# EAGLE design EL-100-020-010-AnalogIN (EAGLE 6.6.0)
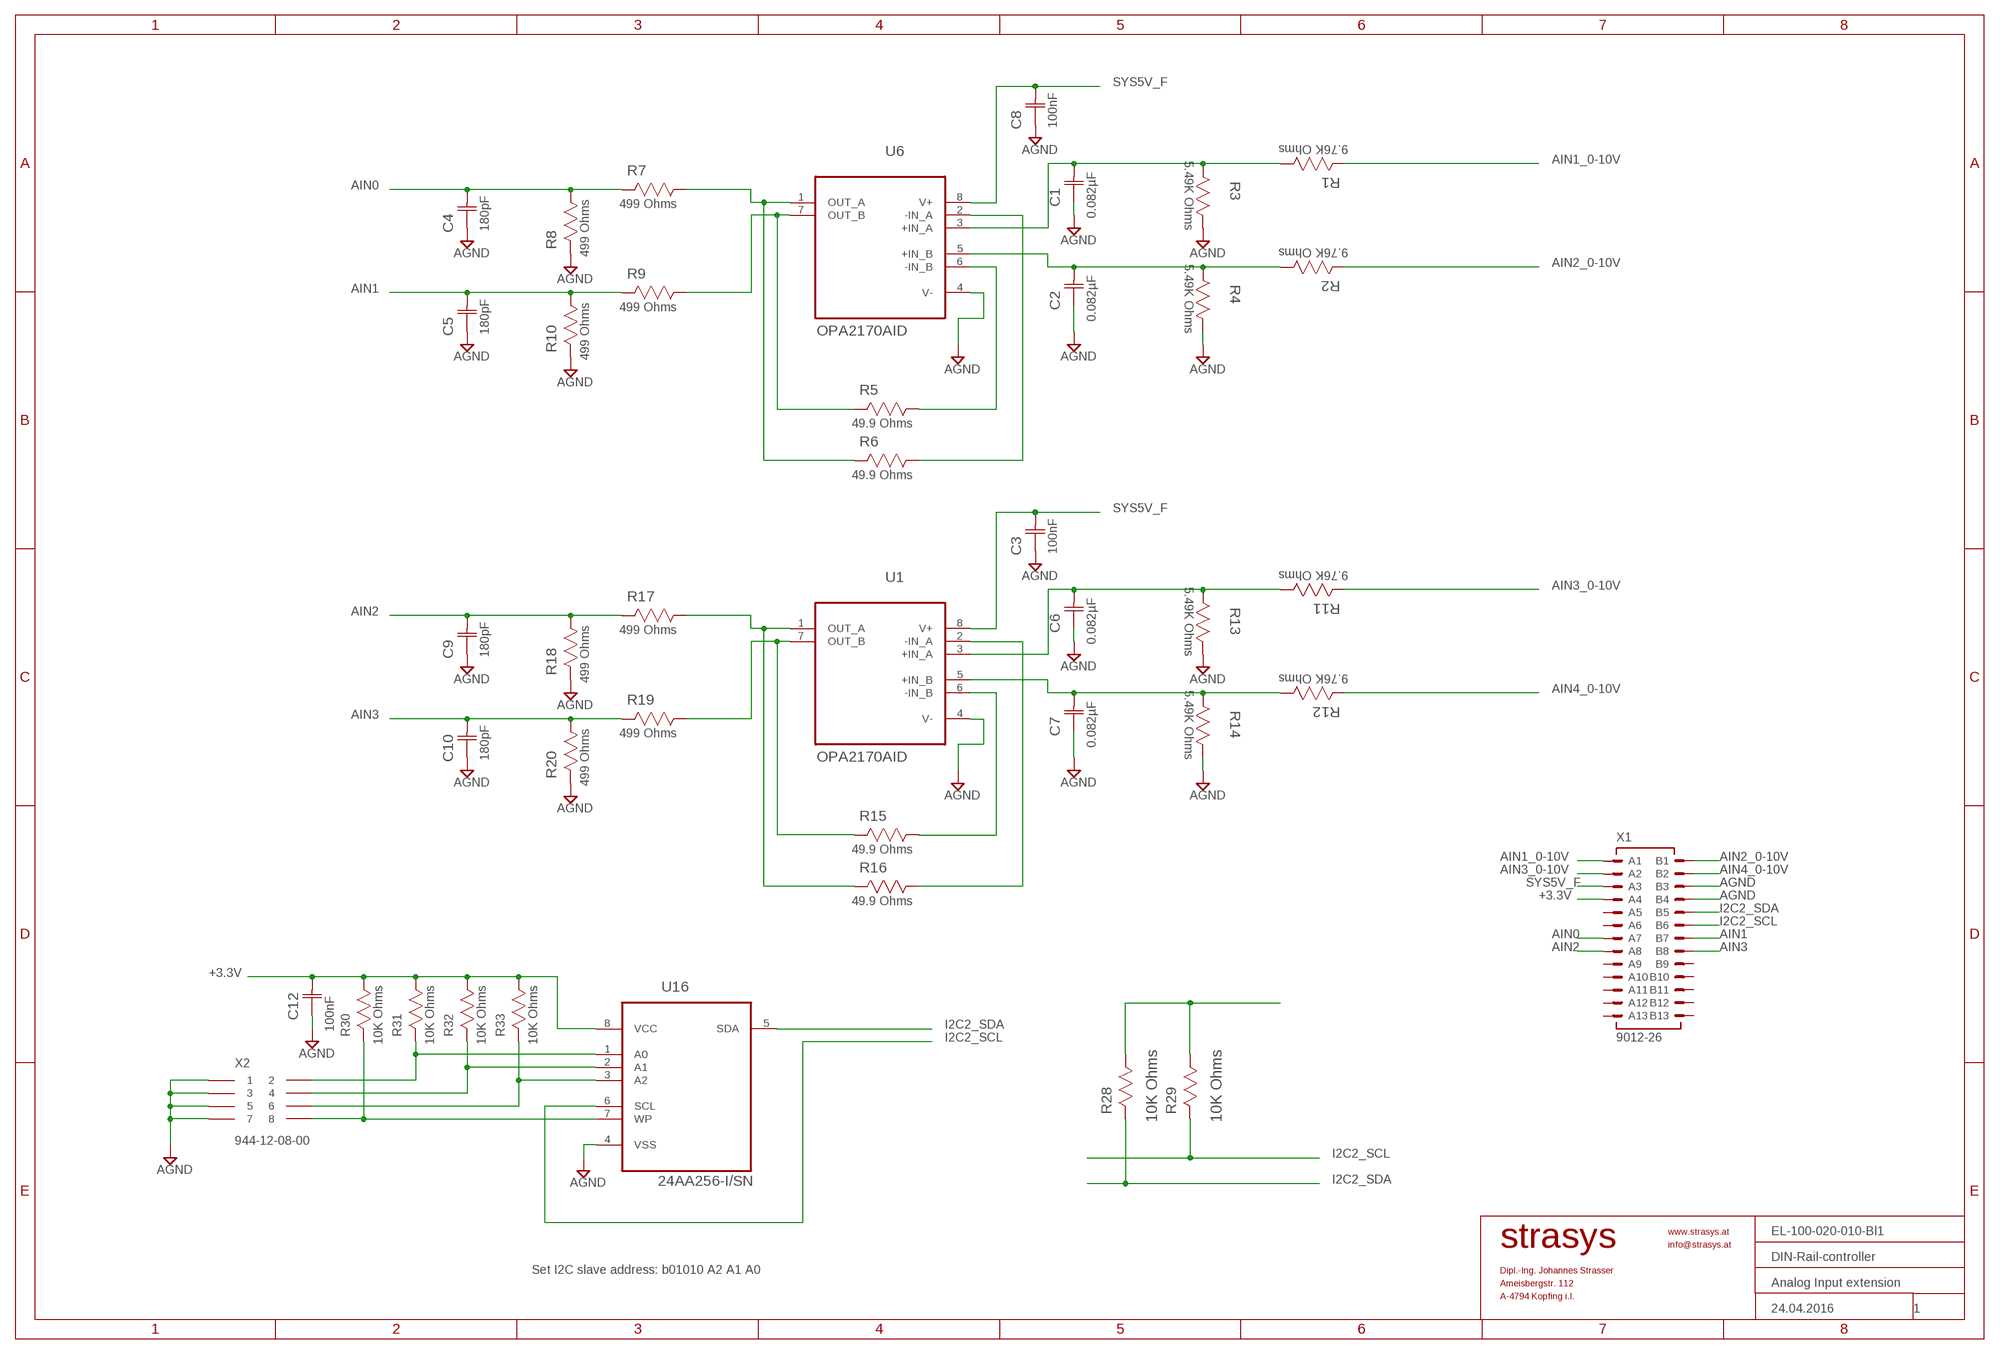
[diagram p0: schematic, sheet 1]
FRAME1 (A3L-LOC): DATE_DRAWING: 24.04.2016; DRAWING_NAME1: DIN-Rail-controller; DRAWING_NAME2: Analog Input extension; DRAWING_NO: EL-100-020-010-Bl1; PAGE: 1

## Parts
C1  0.082µF  C0805C180J5GACTU  [CAPC2013X88N]
C2  0.082µF  C0805C180J5GACTU  [CAPC2013X88N]
C3  100nF  C0805C104K5RACTU  [CAPC2013X110N]
C4  180pF  C0805C180J5GACTU  [CAPC2013X88N]
C5  180pF  C0805C180J5GACTU  [CAPC2013X88N]
C6  0.082µF  C0805C180J5GACTU  [CAPC2013X88N]
C7  0.082µF  C0805C180J5GACTU  [CAPC2013X88N]
C8  100nF  C0805C104K5RACTU  [CAPC2013X110N]
C9  180pF  C0805C180J5GACTU  [CAPC2013X88N]
C10  180pF  C0805C180J5GACTU  [CAPC2013X88N]
C12  100nF  C0805C104K5RACTU  [CAPC2013X110N]
R1  9.76K Ohms  CRCW08059K76FKEA  [RESC2013X65N]
R2  9.76K Ohms  CRCW08059K76FKEA  [RESC2013X65N]
R3  5.49K Ohms  CRCW08055K49FKEA  [RESC2013X65N]
R4  5.49K Ohms  CRCW08055K49FKEA  [RESC2013X65N]
R5  49.9 Ohms  CRCW080549R9FKEA  [RESC2013X65N]
R6  49.9 Ohms  CRCW080549R9FKEA  [RESC2013X65N]
R7  499 Ohms  CRCW0805499RFKEA  [RESC2013X65N]
R8  499 Ohms  CRCW0805499RFKEA  [RESC2013X65N]
R9  499 Ohms  CRCW0805499RFKEA  [RESC2013X65N]
R10  499 Ohms  CRCW0805499RFKEA  [RESC2013X65N]
R11  9.76K Ohms  CRCW08059K76FKEA  [RESC2013X65N]
R12  9.76K Ohms  CRCW08059K76FKEA  [RESC2013X65N]
R13  5.49K Ohms  CRCW08055K49FKEA  [RESC2013X65N]
R14  5.49K Ohms  CRCW08055K49FKEA  [RESC2013X65N]
R15  49.9 Ohms  CRCW080549R9FKEA  [RESC2013X65N]
R16  49.9 Ohms  CRCW080549R9FKEA  [RESC2013X65N]
R17  499 Ohms  CRCW0805499RFKEA  [RESC2013X65N]
R18  499 Ohms  CRCW0805499RFKEA  [RESC2013X65N]
R19  499 Ohms  CRCW0805499RFKEA  [RESC2013X65N]
R20  499 Ohms  CRCW0805499RFKEA  [RESC2013X65N]
R28  10K Ohms  CRCW080510K0JNEA  [RESC2013X65N]
R29  10K Ohms  CRCW080510K0JNEA  [RESC2013X65N]
R30  10K Ohms  CRCW080510K0JNEA  [RESC2013X65N]
R31  10K Ohms  CRCW080510K0JNEA  [RESC2013X65N]
R32  10K Ohms  CRCW080510K0JNEA  [RESC2013X65N]
R33  10K Ohms  CRCW080510K0JNEA  [RESC2013X65N]
U1  OPA2170AID  [SOIC127P600X175-8N]
U6  OPA2170AID  [SOIC127P600X175-8N]
U16  24AA256-I/SN  [SOIC127P600X175-8N]
X1  9012-26  [9012-26]
X2  944-12-08-00  [2,54_2X8]

## Nets
24AA-A0: R31.2 U16.1(A0) X2.P2
24AA_A1: R32.2 U16.2(A1) X2.P4
24AA_A2: R33.2 U16.3(A2) X2.P6
24AA_WP: R30.2 U16.7(WP) X2.P8
+3.3V: C12.2(C2) R28.1 R29.1 R30.1 R31.1 R32.1 R33.1 U16.8(VCC) X1.A4
AGND: C1.1(C1) C2.1(C1) C3.1(C1) C4.1(C1) C5.1(C1) C6.1(C1) C7.1(C1) C8.1(C1) C9.1(C1) C10.1(C1) C12.1(C1) R3.1 R4.1 R8.2 R10.2 R13.1 R14.1 R18.2 R20.2 U1.4(V-) U6.4(V-) U16.4(VSS) X1.B3 X1.B4 X2.P1 X2.P3 X2.P5 X2.P7
AIN0: C4.2(C2) R7.2 R8.1 X1.A7
AIN1: C5.2(C2) R9.2 R10.1 X1.B7
AIN1_0-10V: R1.2 X1.A1
AIN2: C9.2(C2) R17.2 R18.1 X1.A8
AIN2_0-10V: R2.2 X1.B1
AIN3: C10.2(C2) R19.2 R20.1 X1.B8
AIN3_0-10V: R11.2 X1.A2
AIN4_0-10V: R12.2 X1.B2
I2C2_SCL: R29.2 U16.6(SCL) X1.B6
I2C2_SDA: R28.2 U16.5(SDA) X1.B5
N$1: C6.2(C2) R11.1 R13.2 U1.3(+IN_A)
N$3: C7.2(C2) R12.1 R14.2 U1.5(+IN_B)
N$21: C1.2(C2) R1.1 R3.2 U6.3(+IN_A)
N$45: C2.2(C2) R2.1 R4.2 U6.5(+IN_B)
OPA2170_-IN_A_1: R16.1 U1.2(-IN_A)
OPA2170_-IN_A_2: R6.1 U6.2(-IN_A)
OPA2170_-IN_B_1: R15.1 U1.6(-IN_B)
OPA2170_-IN_B_2: R5.1 U6.6(-IN_B)
OPA2170_OUT_A_1: R16.2 R17.1 U1.1(OUT_A)
OPA2170_OUT_A_2: R6.2 R7.1 U6.1(OUT_A)
OPA2170_OUT_B_1: R15.2 R19.1 U1.7(OUT_B)
OPA2170_OUT_B_2: R5.2 R9.1 U6.7(OUT_B)
SYS5V_F: C3.2(C2) C8.2(C2) U1.8(V+) U6.8(V+) X1.A3
Unconnected: X1.A5 X1.A6 X1.A9 X1.A10 X1.A11 X1.A12 X1.A13 X1.B9 X1.B10 X1.B11 X1.B12 X1.B13

## Notes on the sheet
- Set I2C slave address: b01010 A2 A1 A0

## Library data of the parts
C1 C2 C6 C7 = Kemet_By_element14_1:C0805C180J5GACTU: CAPACITOR, 0805; MPN: MC0805B823K500CT; OC_FARNELL: 1759264; SUPPLIER: MULTICOMP; TOLERANCE: ±10%; VALUE: 18pF; VOLTAGERATING: 50V
C3 C8 C12 = Kemet_By_element14_1:C0805C104K5RACTU: CAPACITOR, 0805; MF: KEMET; MPN: C0805C104K5RACTU; OC_FARNELL: 1414664; OC_NEWARK: 65H7431; SUPPLIER: Kemet; TOLERANCE: ±10%; VOLTAGERATING: 50V
C4 C5 C9 C10 = Kemet_By_element14_1:C0805C180J5GACTU: CAPACITOR, 0805; MF: KEMET; MPN: C0805C181J5GACTU; OC_FARNELL: 1414674; SUPPLIER: Kemet; TOLERANCE: ±5%; VALUE: 18pF; VOLTAGERATING: 50V
R1 R2 R11 R12 = Vishay_By_element14_Batch_1:CRCW08059K76FKEA: RESISTOR, 0805; MPN: MCTC0525B9761T5E; OC_FARNELL: 1575899; SUPPLIER: MULTICOMP; TOLERANCE: ±0.1%; WATTAGE: 0.125 W
R3 R4 R13 R14 = Vishay_By_element14_Batch_1:CRCW08055K49FKEA: RESISTOR, 0805; MPN: PCF0805R-5K49BI; OC_FARNELL: 1160182; SUPPLIER: WELWYN; TOLERANCE: ±0.1%; WATTAGE: 0.125 W
R5 R6 R15 R16 = Vishay_By_element14_Batch_1:CRCW080549R9FKEA: RESISTOR, 0805; MPN: MCTC0525B499JT5E; OC_FARNELL: 1575515; SUPPLIER: MULTICOMP; TOLERANCE: ±0.1%; WATTAGE: 0.1 W
R7-R10 R17-R20 = Vishay_By_element14_Batch_1:CRCW0805499RFKEA: RESISTOR, 0805; MPN: ERA6AEB4990V; OC_FARNELL: 1810472; SUPPLIER: PANASONIC ELECTRONIC COMPONENTS; TOLERANCE: ±0.1%; WATTAGE: 0.125 W
R28-R33 = Vishay_By_element14_Batch_1:CRCW080510K0JNEA: RESISTOR, 0805; MF: VISHAY DRALORIC; MPN: CRCW080510K0JNEA; OC_FARNELL: 1469857; OC_NEWARK: 52K9797; SUPPLIER: Vishay; TOLERANCE: ±5%; WATTAGE: 0.125 W
U1 U6 = strasys_standard:OPA2170AID: Low-Power OPERATIONAL AMPLIFIERS,SOIC- 8; MF: TEXAS INSTRUMENTS; MPN: OPA2170AID; OC_FARNELL: 2144252; OC_NEWARK: 05W9871; PACKAGE: SOIC- 8; SUPPLIER: TEXAS INSTRUMENTS
U16 = Microchip_By_element14_Batch_1:24AA256-I/SN: EEPROM; MF: MICROCHIP; MPN: 24AA256-I/SN; OC_FARNELL: 1331295; OC_NEWARK: 92C6874; PACKAGE: SOIC-8; SUPPLIER: MICROCHIP
X1 = con-WuP:9012-26: SMT-Buchsenleiste RM 1,27mm, liegend; MPN: 9012-26; SUPPLIER: W+P
X2 = strasys_standard:944-12-08-00: Stiftleiste RM 2,54mm gerade 2 x 4

## Board
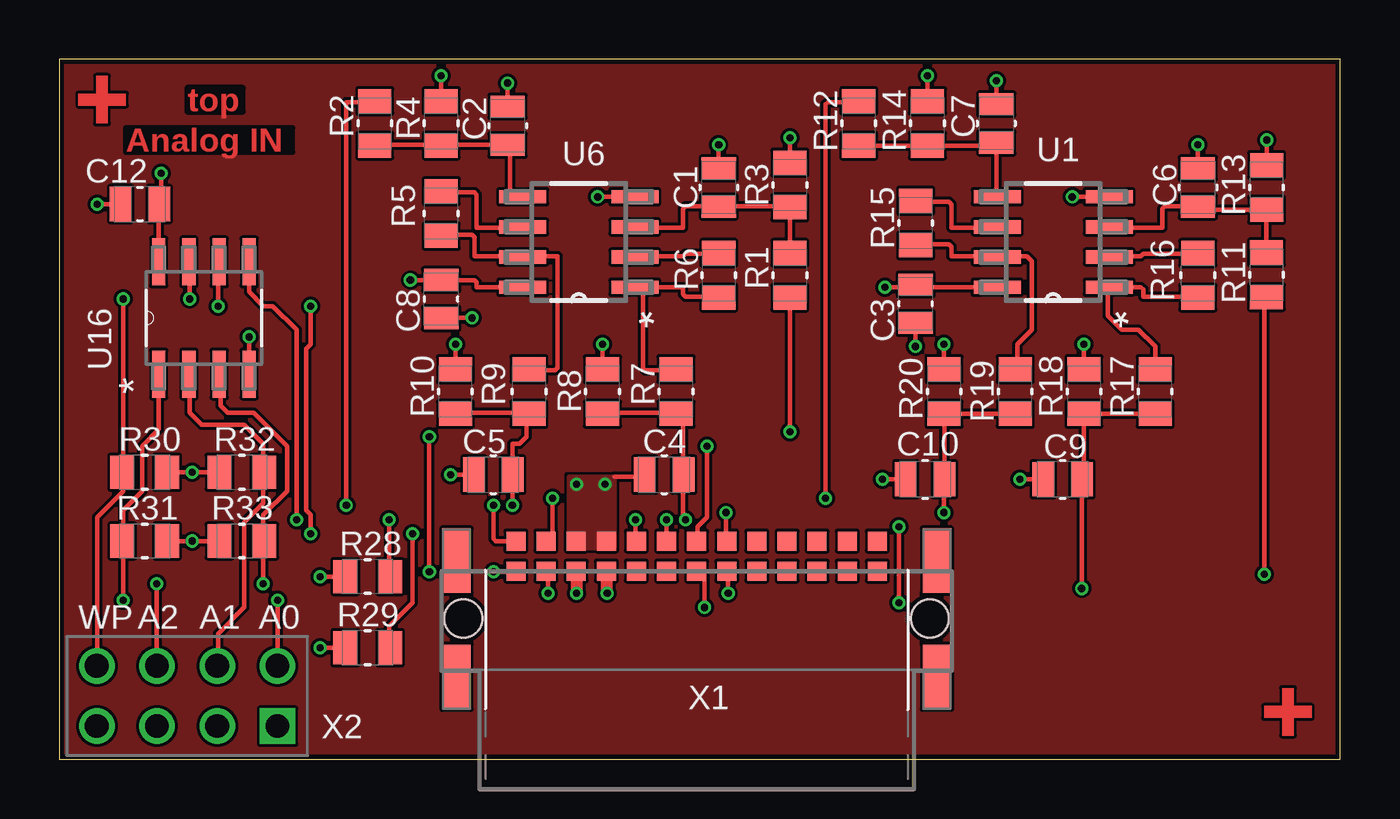
[diagram p1: board, top side]
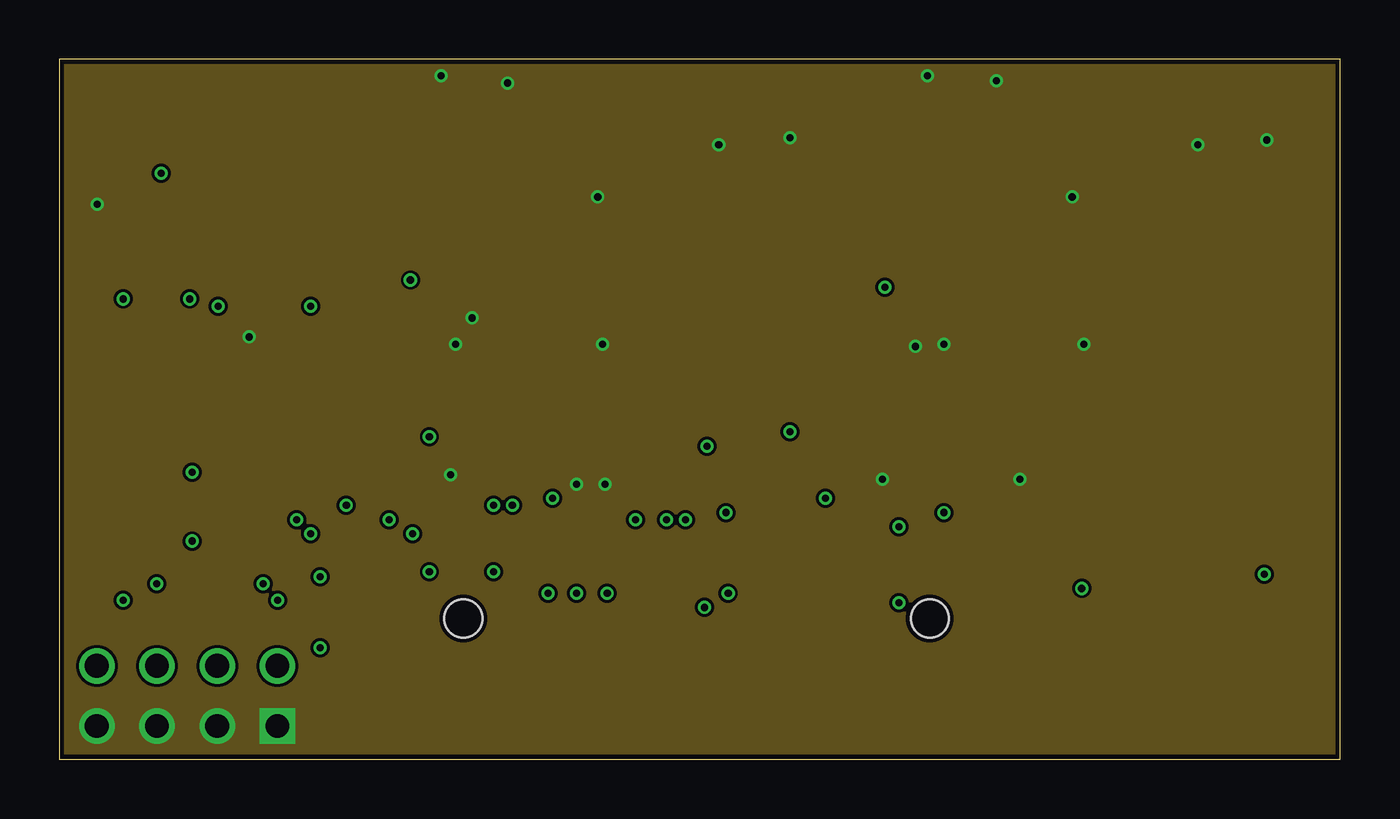
[diagram p2: board, inner layer GND]
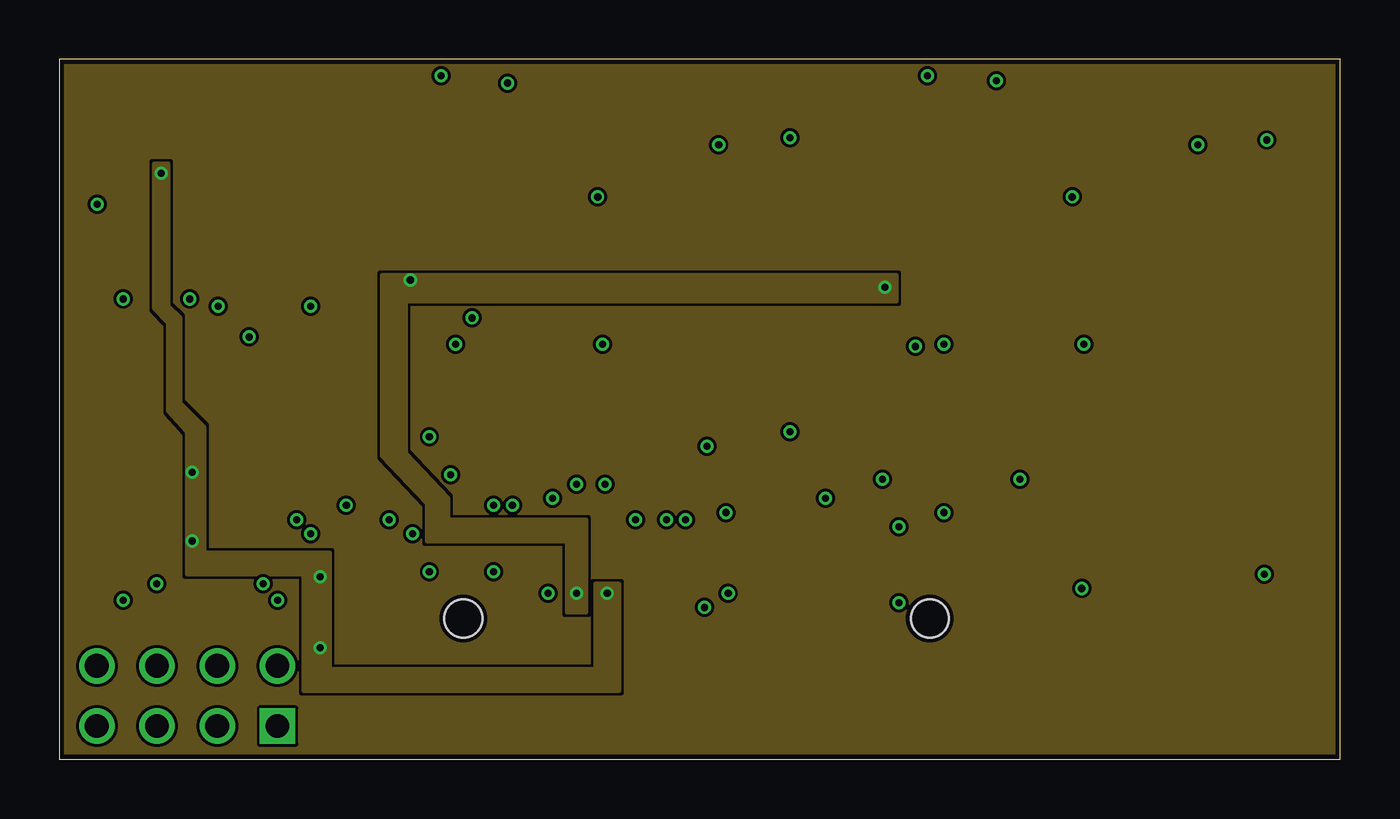
[diagram p3: board, inner layer PWR]
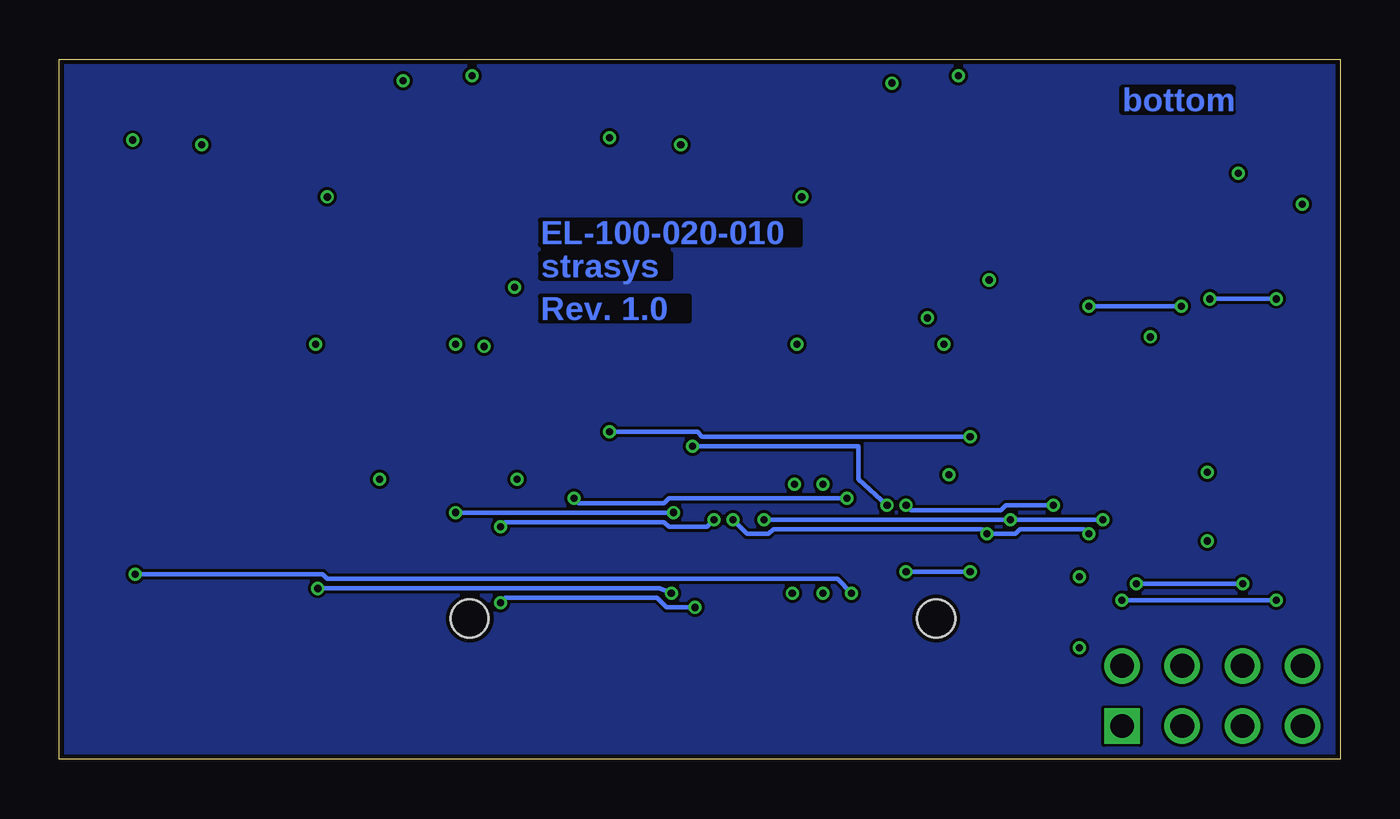
[diagram p4: board, bottom side, seen from below]

Size 54 x 29.5 mm. Coordinates in mm from the lower left corner, seen from the top.
Outline: 0,0 54,0 54,29.5 0,29.5 0,0
Copper layers (1+2*15+16): Top 0.018mm / dielectric 0.36mm / GND 0.035mm / dielectric 0.71mm / PWR 0.035mm / dielectric 0.2mm / Bottom 0.018mm
Design rules "Multi-CB_4L_125um-Tracks_OL35um-IL35um *": minimum track width 0.125mm, minimum drill 0.2mm, track to track 0.125mm, track to pad 0.125mm, pad to pad 0.125mm, via to via 0.125mm, smd to smd 0mil, copper to edge 0.2mm, drill to drill 0.2mm, minimum pad ring 0.125mm, minimum via ring 0.125mm, stop-mask expansion 2mil, vias tented up to drill 0.45mm, thermal gap 0.2mm

### Footprints (pad centres in the part's own frame; a part is rotated, then mirrored left to right if it is on the bottom)
CAPC2013X88N = smd 0.914 x 1.448: 1 -0.813,0; 2 0.813,0
CAPC2013X110N = smd 0.914 x 1.448: 1 -0.813,0; 2 0.813,0
RESC2013X65N = smd 1.016 x 1.397: 1 -0.94,0; 2 0.94,0
SOIC127P600X175-8N = smd 1.981 x 0.559: 1 -2.362,1.905; 2 -2.362,0.635; 3 -2.362,-0.635; 4 -2.362,-1.905; 5 2.362,-1.905; 6 2.362,-0.635; 7 2.362,0.635; 8 2.362,1.905
9012-26 = smd 0.8 x 0.8: A1 -7.62,2; A2 -6.35,2; A3 -5.08,2; A4 -3.81,2; A5 -2.54,2; A6 -1.27,2; A7 0,2; A8 1.27,2; A9 2.54,2; A10 3.81,2; A11 5.08,2; A12 6.35,2; A13 7.62,2; B1 -7.62,3.27; B2 -6.35,3.27; B3 -5.08,3.27; B4 -3.81,3.27; B5 -2.54,3.27; B6 -1.27,3.27; B7 0,3.27; B8 1.27,3.27; B9 2.54,3.27; B10 3.81,3.27; B11 5.08,3.27; B12 6.35,3.27; B13 7.62,3.27 | smd 1.2 x 2.7: M1 -10.13,2.45; M2 -10.13,-2.45; M3 10.13,2.45; M4 10.13,-2.45 | hole 1.6: -9.83,0; 9.83,0
2,54_2X8 = drill 1 square: P1 0,0 | drill 1: P2 0,-2.54; P3 2.54,0; P4 2.54,-2.54; P5 5.08,0; P6 5.08,-2.54; P7 7.62,0; P8 7.62,-2.54

### Placement (x,y rotation side)
C1  27.8,24.1 270 top
C2  18.9,26.7 270 top
C3  36.1,19.2 90 top
C4  25.5,12 0 top
C5  18.3,12 0 top
C6  48,24.1 270 top
C7  39.5,26.8 270 top
C8  16.1,19.4 90 top
C9  42.3,11.8 0 top
C10  36.5,11.8 0 top
C12  3.4,23.4 0 top
R1  30.8,20.4 270 top
R2  13.3,26.8 90 top
R3  30.8,24.2 270 top
R4  16.1,26.8 270 top
R5  16.1,23 270 top
R6  27.8,20.4 270 top
R7  26,15.5 270 top
R8  22.9,15.5 90 top
R9  19.8,15.5 270 top
R10  16.7,15.5 90 top
R11  50.89,20.42 270 top
R12  33.7,26.8 90 top
R13  50.9,24.1 270 top
R14  36.6,26.8 270 top
R15  36.1,22.6 270 top
R16  48,20.4 270 top
R17  46.2,15.5 270 top
R18  43.2,15.5 90 top
R19  40.3,15.5 270 top
R20  37.3,15.5 90 top
R28  13,7.7 0 top
R29  13,4.7 0 top
R30  3.6,12.1 180 top
R31  3.6,9.2 180 top
R32  7.7,12.1 0 top
R33  7.7,9.2 0 top
U1  41.9,21.8 180 top
U6  21.9,21.8 180 top
U16  6.1,18.6 90 top
U$1  [PASSER_SMD4]  1.8,27.8 0 top
U$2  [PASSER_SMD4]  51.8,2 0 top
X1  26.87,5.93 0 top
X2  9.2,1.4 180 top

### Tracks (layer width: path | path; a pad name or v marks a point on that pad's centre or on a via)
24AA-A0  (via drill 0.3)
  Top 0.2: v2.7,6.7 2.7,9.2 | X2.P2 v9.2,6.7 | 2.7,9.2 2.7,10.5 3.5,11.3 3.5,13.2 4.2,13.9 4.2,16.2 U16.1 | 2.7,9.2 R31.2
  Bottom 0.2: v9.2,6.7 v2.7,6.7
24AA_A1
  Top 0.2: 8.6,12.1 8.6,10.8 7.8,10 7.8,6.4 6.7,5.3 6.7,4 X2.P4 | 8.6,12.1 R32.2 | 8.6,12.1 8.6,13.3 7.8,14.1 6,14.1 5.5,14.6 5.5,16.2 U16.2
24AA_A2  (via drill 0.3)
  Top 0.2: v8.6,7.4 8.6,9.2 | v4.1,7.4 4.1,4 X2.P6 | 8.6,9.2 8.6,10.3 9.6,11.3 9.6,13.2 8.2,14.6 7.1,14.6 6.8,14.9 6.8,16.17 U16.3 | 8.6,9.2 R33.2
  Bottom 0.2: v4.1,7.4 v8.6,7.4
24AA_WP  (via drill 0.3)
  Top 0.2: 2.7,12.1 2.7,11.3 1.6,10.2 1.6,4 X2.P8 | v5.5,19.4 5.5,20.9 U16.7 | 2.7,12.1 v2.7,19.4 | 2.7,12.1 R30.2
  Bottom 0.2: v2.7,19.4 v5.5,19.4
+3.3V  (via drill 0.3)
  Top 0.2: U16.8 4.2,21 C12.2 4.3,23.49 v4.3,24.7 | R31.1 v5.6,9.2 R33.1 | R30.1 v5.6,12.1 R32.1 | v11,7.7 R28.1 | v11,4.7 R29.1
  Top 0.5: v23.1,7 23.1,7.89 X1.A4
  pour PWR (no thermals): 22.6,7.4 22.6,3.8 11.4,3.8 11.4,8.7 6.1,8.7 6.1,14 5.1,15 5.1,18.6 4.6,19.1 4.6,25.1 4,25.1 4,19 4.6,18.4 4.6,14.7 5.4,13.8 5.4,7.8 10.3,7.8 10.3,2.9 23.6,2.9 23.6,7.4
AGND  (via drill 0.3)
  Top 0.2: C12.1 v1.6,23.4 | U16.4 v8.01,17.8 v8,17.8 | v36.6,28.8 R14.1 | v39.5,28.6 C7.1 | C6.1 v48,25.9 | R13.1 v50.9,26.1 | v42.7,23.7 44.2,23.7 U1.4 | C3.1 v36.1,17.4 | R20.2 v37.3,17.5 | C10.1 v34.7,11.8 | C9.1 v40.5,11.8 | R18.2 v43.2,17.5 | 23.4,11.9 24.7,11.9 C4.1 | R10.2 v16.7,17.5 | R8.2 v22.9,17.5 | C5.1 v16.5,12 | v17.4,18.6 C8.1 | v16.1,28.8 R4.1 | v18.9,28.5 C2.1 | v27.8,25.9 C1.1 | v30.8,26.2 R3.1 | v22.7,23.7 24.2,23.7 U6.4
  other vias: 21.8,11.6 23,11.6
  pour GND (no thermals): 0,0 0,29.5 54,29.5 54,0
  pour Top (no thermals): 21.5,11.9 21.5,8.9 23.4,8.9 23.4,11.9
AIN0  (via drill 0.3)
  Top 0.2: C4.2 26.3,10.2 v26.4,10.1 | v35.4,6.6 v35.4,9.8 | v27.2,6.4 27.2,7.9 26.9,7.9 X1.A7 | C4.2 26.3,14.6 26,14.6 | C4.2 | 26,14.6 22.9,14.6 R8.1 | 26,14.6 R7.2
  Bottom 0.2: v26.4,10.1 26.7,9.8 28.3,9.8 28.5,10 35.2,10 v35.4,9.8 | v35.4,6.6 35.2,6.8 28.8,6.8 28.4,6.4 v27.2,6.4
AIN1  (via drill 0.3)
  Top 0.2: v27.3,13.2 27.3,10.2 26.9,9.8 26.9,9.2 X1.B7 | C5.2 | v19.1,10.7 C5.2 | C5.2 19.1,13.3 19.4,13.3 19.7,13.6 19.7,14.6 | 19.7,14.6 19.8,14.6 R9.2 19.7,14.6 | 19.7,14.6 16.7,14.6 R10.1
  Bottom 0.2: v27.3,13.2 20.3,13.2 20.3,11.8 v19.1,10.7
AIN1_0-10V  (via drill 0.3)
  Top 0.2: v30.8,13.8 R1.2 | v15.6,7.9 v15.6,13.6 | v18.3,7.9 19.2,7.9 X1.A1
  Bottom 0.2: v30.8,13.8 27.1,13.8 26.9,13.6 v15.6,13.6 | v18.3,7.9 v15.6,7.9
AIN2  (via drill 0.3)
  Top 0.2: R17.2 R18.1 43.2,11.89 C9.2 v43.1,7.2 | v28.2,7 28.2,7.9 X1.A8
  Bottom 0.2: v43.1,7.2 28.7,7.2 v28.2,7
AIN2_0-10V  (via drill 0.3)
  Top 0.2: v12.1,10.7 12.1,27.7 13.3,27.7 R2.2 | v18.3,10.7 18.3,9.3 18.4,9.2 X1.B1
  Bottom 0.2: v12.1,10.7 14.1,10.7 14.3,10.5 18.1,10.5 v18.3,10.7
AIN3  (via drill 0.3)
  Top 0.2: R19.2 R20.1 37.31,14.55 C10.2 v37.3,10.4 | v28.1,10.4 28.1,9.2 X1.B8
  Bottom 0.2: v28.1,10.4 v37.3,10.4
AIN3_0-10V  (via drill 0.3)
  Top 0.2: v20.6,7 20.6,7.9 X1.A2 | v50.8,7.8 50.8,19.5 R11.2
  Bottom 0.2: v20.6,7 21.2,7.6 42.7,7.6 42.9,7.8 v50.8,7.8
AIN4_0-10V  (via drill 0.3)
  Top 0.2: R12.2 33.7,27.7 32.4,27.7 32.3,27.6 v32.3,11 32.3,10.9 | v20.8,11 20.8,9.3 20.7,9.2 X1.B2
  Bottom 0.2: v32.3,11 32.1,10.8 28.5,10.8 28.3,11 v20.8,11
I2C2_SCL  (via drill 0.3)
  Top 0.2: v14.9,9.5 14.9,6.6 13.9,5.6 13.9,4.7 R29.2 | X1.B6 v25.6,10.1 | v10.6,19.1 10.6,17.5 10.4,17.3 10.4,10.5 10.6,10.3 v10.6,9.5 | v6.7,19.1 6.7,20.9 U16.6
  Bottom 0.2: v25.6,10.1 25,9.5 24.1,9.5 23.9,9.7 15.1,9.7 v14.9,9.5 13.7,9.5 13.5,9.7 10.8,9.7 v10.6,9.5 | v10.6,19.1 v6.7,19.1
I2C2_SDA  (via drill 0.3)
  Top 0.2: v13.9,10.1 13.9,7.7 R28.2 | v24.3,10.1 24.3,9.2 X1.B5 | v10,10.1 10,18.1 9,19.1 8.6,19.1 8,19.7 8,20.9 U16.5
  Bottom 0.2: v24.3,10.1 v13.9,10.1 v10,10.1
N$1
  Top 0.2: R11.1 R13.2 48.13,23.16 C6.2 46.6,23.3 46.5,23.2 46.5,22.4 44.3,22.4 U1.3
N$3
  Top 0.2: U1.5 39.5,23.74 C7.2 39.37,25.86 R14.2 R12.1
N$21
  Top 0.2: C1.2 30.7,23.3 R3.2 R1.1 | C1.2 26.4,23.3 26.3,23.2 26.3,22.4 24.3,22.4 U6.3 | C1.2
N$45
  Top 0.2: 19,25.9 19,23.7 19.5,23.7 U6.5 | 19,25.9 19,26 | 16.1,25.9 13.3,25.9 R2.1 | 16.1,25.9 19,25.9 | 19,25.9 C2.2 | 16.1,25.9 R4.2
OPA2170_-IN_A_1
  Top 0.2: R16.1 48,21.3 45.7,21.3 45.6,21.2 44.3,21.2 U1.2
OPA2170_-IN_A_2
  Top 0.2: U6.2 24.3,21.2 26.3,21.2 26.4,21.3 27.8,21.3 R6.1
OPA2170_-IN_B_1
  Top 0.2: U1.6 39.5,22.4 37.6,22.4 37.6,23.4 37.5,23.5 36.1,23.5 R15.1
OPA2170_-IN_B_2
  Top 0.2: U6.6 19.5,22.4 17.6,22.4 17.6,23.8 17.5,23.9 16.1,23.9 R5.1
OPA2170_OUT_A_1
  Top 0.2: R16.2 48,19.5 45.7,19.5 45.7,19.8 45.6,19.9 44.3,19.9 U1.1 44.2,19.83 44.2,18.7 44.8,18.1 45.5,18.1 46.2,17.4 R17.1
OPA2170_OUT_A_2
  Top 0.2: 24.6,19.9 26.3,19.9 26.3,19.6 26.4,19.5 27.8,19.5 R6.2 | 24.6,19.9 24.3,19.9 U6.1 24.6,19.9 | 24.6,19.9 24.6,16.5 24.7,16.4 26,16.4 R7.1
OPA2170_OUT_B_1
  Top 0.2: R15.2 36.1,21.7 37.5,21.7 37.6,21.6 37.6,21.2 39.5,21.2 U1.7 39.6,21.2 40.8,21.2 41,21 41,18.1 40.4,17.5 40.4,16.4 40.3,16.4 R19.1
OPA2170_OUT_B_2
  Top 0.2: R5.2 16.1,22.1 17.4,22.1 17.5,22 17.5,21.2 19.5,21.2 U6.7 19.6,21.2 21,21.2 21,16.5 20.9,16.4 19.8,16.4 R9.1
PE
  pour Top (rank 6, no thermals): 0,29.5 0,0 54,0 54,29.5
  pour Bottom (rank 6): 0,29.5 0,0 54,0 54,29.5
  pour PWR (rank 6): 0,29.5 54,29.5 54,0 0,0
SYS5V_F  (via drill 0.3)
  Top 0.2: 36.1,19.9 39.5,19.9 U1.8 | 36.1,19.9 C3.2 | C8.2 17.5,20.2 17.6,20.1 17.6,19.9 19.5,19.9 U6.8 | 36.1,19.9 v34.8,19.9 | v14.8,20.2 C8.2 | C8.2
  Top 0.5: X1.A3 v21.8,7
  pour PWR (no thermals): 13.6,20.4 35.3,20.4 35.3,19.3 13.6,19.3
  pour PWR (no thermals): 22.2,10.1 22.2,6.2 21.4,6.2 21.4,9.2 15.5,9.2 15.5,10.8 13.6,12.8 13.6,20.4 14.6,20.4 14.6,12.9 16.4,11 16.4,10.1

### Text on the board
Top: top | Analog IN
Bottom: bottom | EL-100-020-010 | strasys | Rev. 1.0
tPlace: A2 | A1 | A0
tNames: WP